# EAGLE design RTC_pb (EAGLE 6.1)
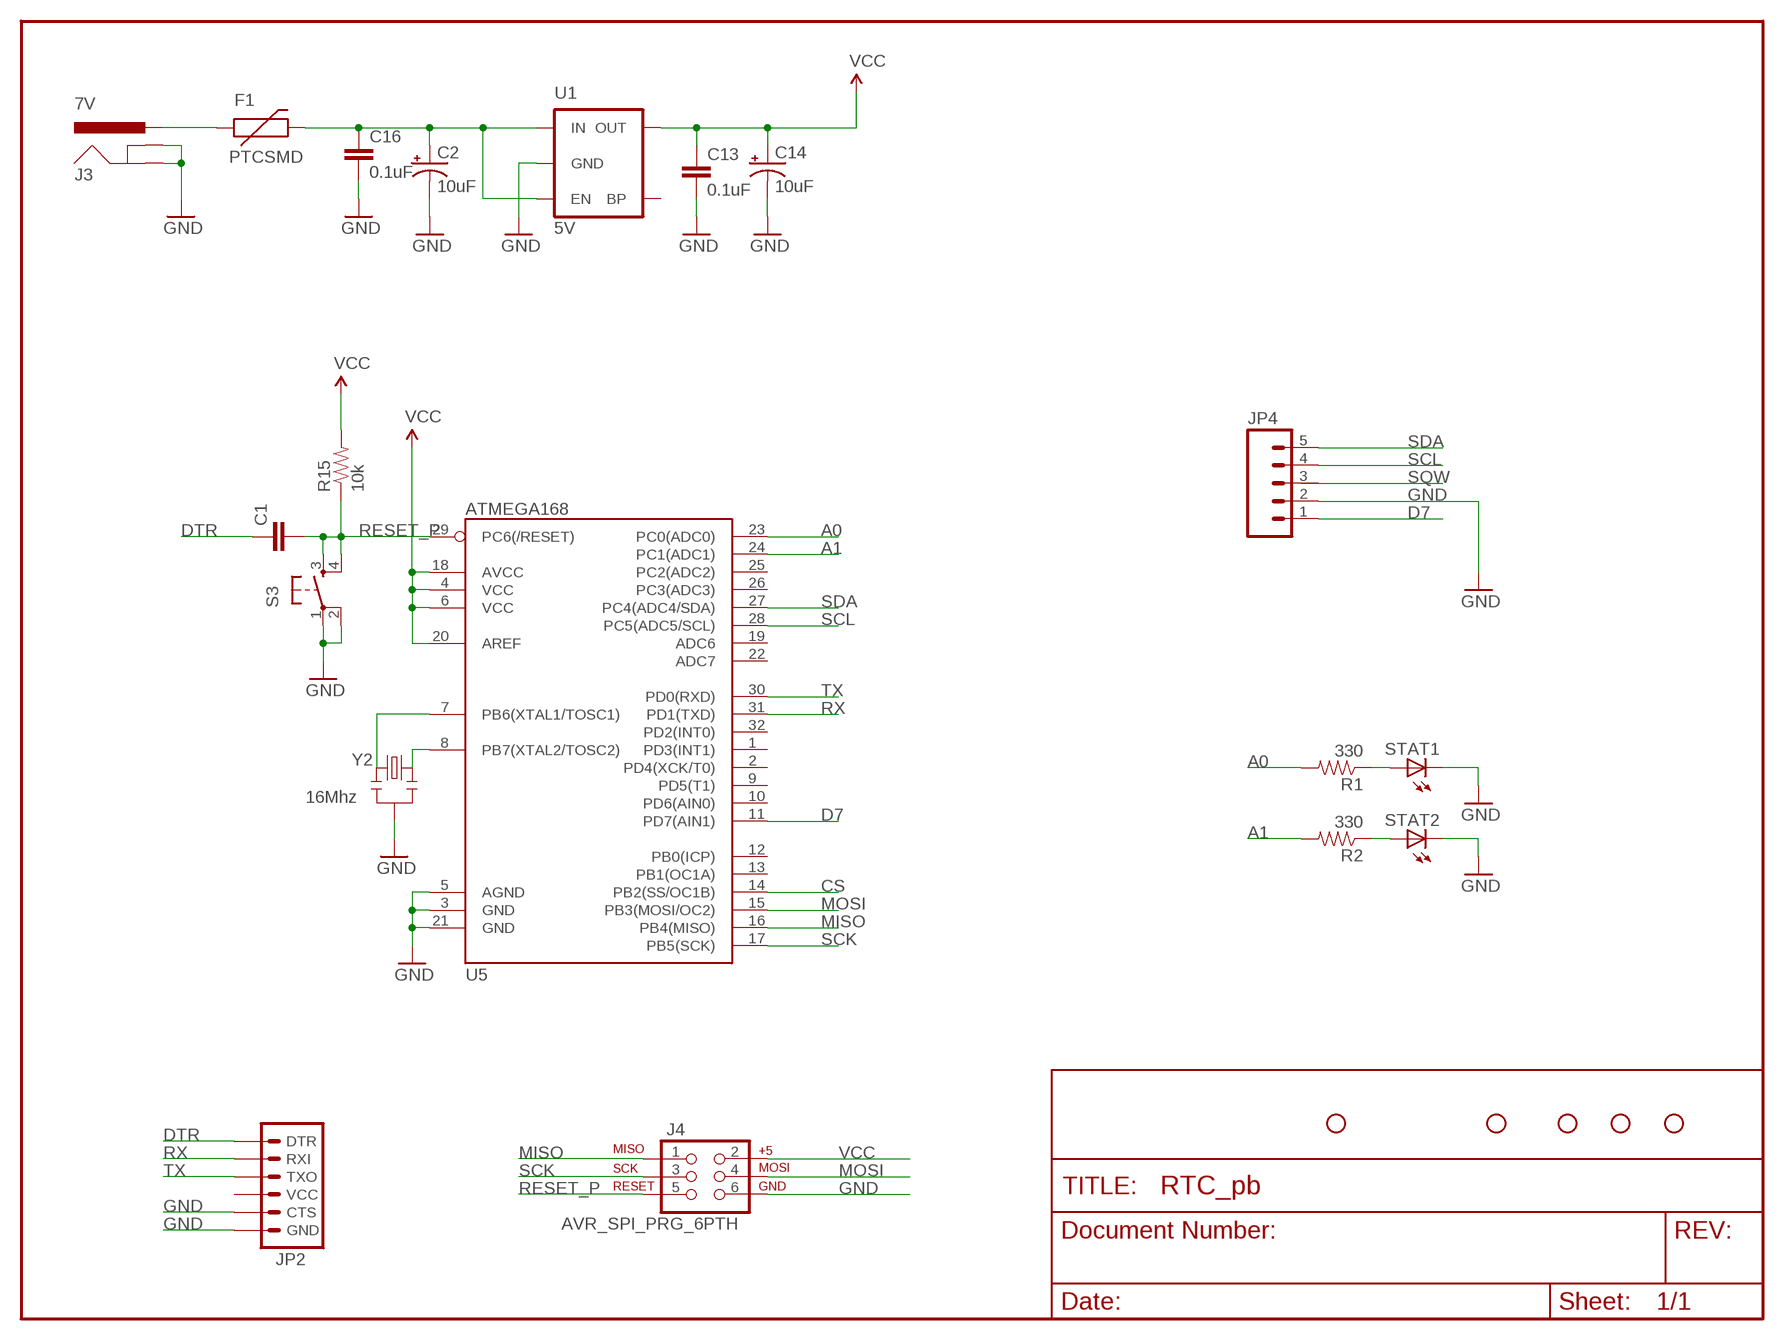
[diagram p0: schematic, sheet 1]

## Parts
C1  CAP0603-CAP  [0603-CAP]
C2  10uF  CAP_POL1206  [EIA3216]
C13  0.1uF  CAP0603-CAP  [0603-CAP]
C14  10uF  CAP_POL1206  [EIA3216]
C16  0.1uF  CAP0603-CAP  [0603-CAP]
F1  PTCSMD  [PTC-1206]
J3  7V  POWER_JACKPTH_LOCK  [POWER_JACK_PTH_LOCK]
J4  AVR_SPI_PRG_6PTH  [2X3]
JP1  STAND-OFFTIGHT  [STAND-OFF-TIGHT]
JP2  ARDUINO_SERIAL_PROGRAMPTH  [1X06]
JP4  M05PTH_LONGPADS  [1X05_LONGPADS]
JP7  STAND-OFFTIGHT  [STAND-OFF-TIGHT]
JP8  STAND-OFFTIGHT  [STAND-OFF-TIGHT]
JP9  STAND-OFFTIGHT  [STAND-OFF-TIGHT]
JP10  STAND-OFFTIGHT  [STAND-OFF-TIGHT]
R1  330  RESISTOR0603-RES  [0603-RES]
R2  330  RESISTOR0603-RES  [0603-RES]
R15  10k  RESISTOR0603-RES  [0603-RES]
S3  TAC_SWITCHPTH  [TACTILE-PTH]
STAT1  Yellow  LED1206  [LED-1206]
STAT2  Yellow  LED1206  [LED-1206]
U1  3.3V  V_REG_LDOSMD  [SOT23-5]
U5  ATMEGA168  [TQFP32-08]
Y2  8MHz  RESONATORSMD  [RESONATOR-SMD]

## Nets
A0: R1.2 U5.23(PC0(ADC0))
A1: R2.2 U5.24(PC1(ADC1))
CS: U5.14(PB2(SS/OC1B))
D7: JP4.1 U5.11(PD7(AIN1))
DTR: C1.1 JP2.1(DTR)
GND: C2.C(-) C13.2 C14.C(-) C16.2 J3.GND J3.GNDBREAK J4.6 JP2.5(CTS) JP2.6(GND) JP4.2 S3.1 S3.2 STAT1.C STAT2.C U1.2(GND) U5.3(GND) U5.5(AGND) U5.21(GND) Y2.2
MISO: J4.1 U5.16(PB4(MISO))
MOSI: J4.4 U5.15(PB3(MOSI/OC2))
N$1: R1.1 STAT1.A
N$2: R2.1 STAT2.A
N$4: C2.A(+) C16.1 F1.2 U1.1(IN) U1.3(EN)
N$141: U5.8(PB7(XTAL2/TOSC2)) Y2.3
N$142: U5.7(PB6(XTAL1/TOSC1)) Y2.1
RAW: F1.1 J3.PWR
RESET_P: C1.2 J4.5 R15.1 S3.3 S3.4 U5.29(PC6(/RESET))
RX: JP2.2(RXI) U5.31(PD1(TXD))
SCK: J4.3 U5.17(PB5(SCK))
SCL: JP4.4 U5.28(PC5(ADC5/SCL))
SDA: JP4.5 U5.27(PC4(ADC4/SDA))
TX: JP2.3(TXO) U5.30(PD0(RXD))
VCC: C13.1 C14.A(+) J4.2 R15.2 U1.5(OUT) U5.4(VCC) U5.6(VCC) U5.18(AVCC) U5.20(AREF)
Unconnected: JP2.4(VCC) JP4.3 U1.4(BP) U5.1(PD3(INT1)) U5.2(PD4(XCK/T0)) U5.9(PD5(T1)) U5.10(PD6(AIN0)) U5.12(PB0(ICP)) U5.13(PB1(OC1A)) U5.19(ADC6) U5.22(ADC7) U5.25(PC2(ADC2)) U5.26(PC3(ADC3)) U5.32(PD2(INT0))

## Notes on the sheet
- 5V
- 16Mhz

## Library data of the parts
C1 C13 C16 = SparkFun:CAP: Capacitor Standard 0603 ceramic capacitor, and 0.1" leaded capacitor.
C2 C14 = SparkFun:CAP_POL: Capacitor Polarized These are standard SMD and PTH capacitors. Normally 10uF, 47uF, and 100uF in electrolytic and tantalum varieties. Always verify the external diameter of the through hole cap, it varies with capacity, voltage, and manufacturer. The EIA devices should be standard.
F1 = SparkFun:PTC: Resettable Fuse PTC Resettable Fuse. Spark Fun Electronics SKU : COM-08357
J3 = SparkFun:POWER_JACK: Power Jack This is the standard 5.5mm barrel jack for power. The PTH is the most common, proven, reliable, footprint. All others are experimental. The Slot footprint only works if the mill layer is transmitted to the PCB fab house so be warned. Spark Fun Electronics SKU : PRT-00119. Mating wall wart : TOL-00298 (and others)
J4 = SparkFun:AVR_SPI_PRG_6: AVR ISP 6 Pin This is the reduced ISP connector for AVR programming. Common on Arduino. This footprint will take up less PCB space and can be used with a 10-pin to 6-pin adapter such as SKU: BOB-08508
JP1 JP7-JP10 = SparkFun:STAND-OFF: Stand Off This is the mechanical footprint for a #4 phillips button head screw. Use the keepout ring to avoid running the screw head into surrounding components. SKU : PRT-00447
JP2 = SparkFun:ARDUINO_SERIAL_PROGRAM
JP4 = SparkFun:M05: Header 5 Standard 5-pin 0.1" header. Use with straight break away headers (SKU : PRT-00116), right angle break away headers (PRT-00553), swiss pins (PRT-00743), machine pins (PRT-00117), and female headers (PRT-00115). Molex polarized connector foot print use with SKU : PRT-08230 with associated crimp pins and housings.
R1 R2 R15 = SparkFun:RESISTOR: Resistor Basic schematic elements and footprints for 0603, 1206, and PTH resistors.
S3 = SparkFun:TAC_SWITCH: Momentary Switch Button commonly used for reset or general input. Spark Fun Electronics SKU : COM-00097
STAT1 STAT2 = SparkFun:LED: LEDs Standard schematic elements and footprints for 5mm, 3mm, 1206, and 0603 sized LEDs. 5mm - Spark Fun Electronics SKU : COM-00529 (and others)
U1 = SparkFun:V_REG_LDO: Voltage Regulator LDO Standard 150mA LDO voltage regulator in SOT-23 layout. Micrel part MIC5205. BP (by-pass) pin is used to lower output noise with 470pF cap.
U5 = SparkFun:ATMEGA168
Y2 = SparkFun:RESONATOR: Resonator Small SMD resonator. This is the itty bitty 10/20MHz resonators with built in caps. CSTCE10M0G55 and CSTCE20M0V53. Footprint has been reviewed closely but hasn't been tested yet.

## Board
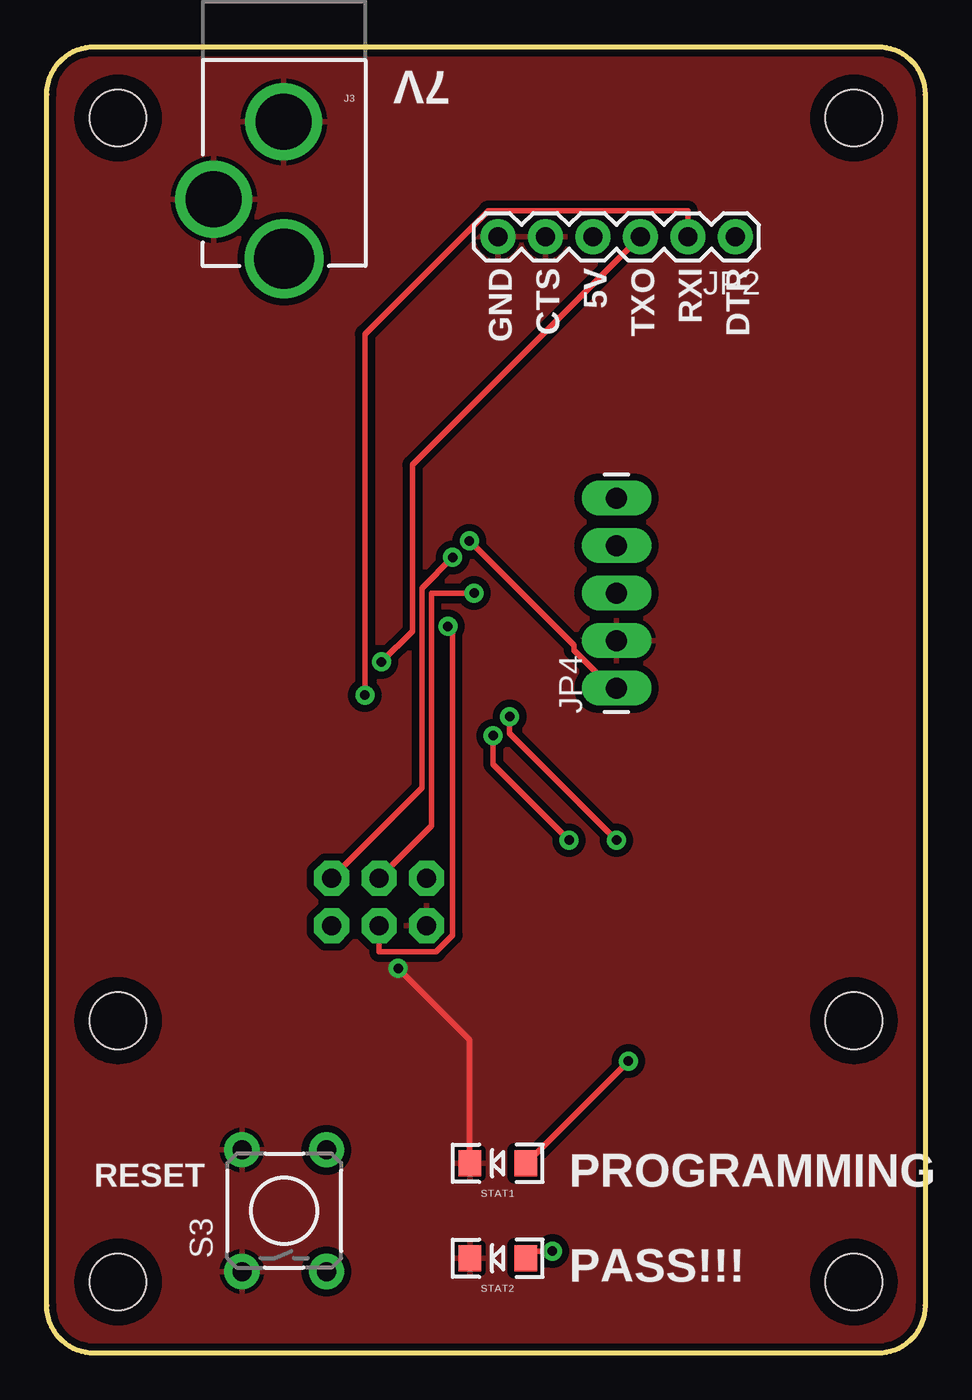
[diagram p1: board, top side]
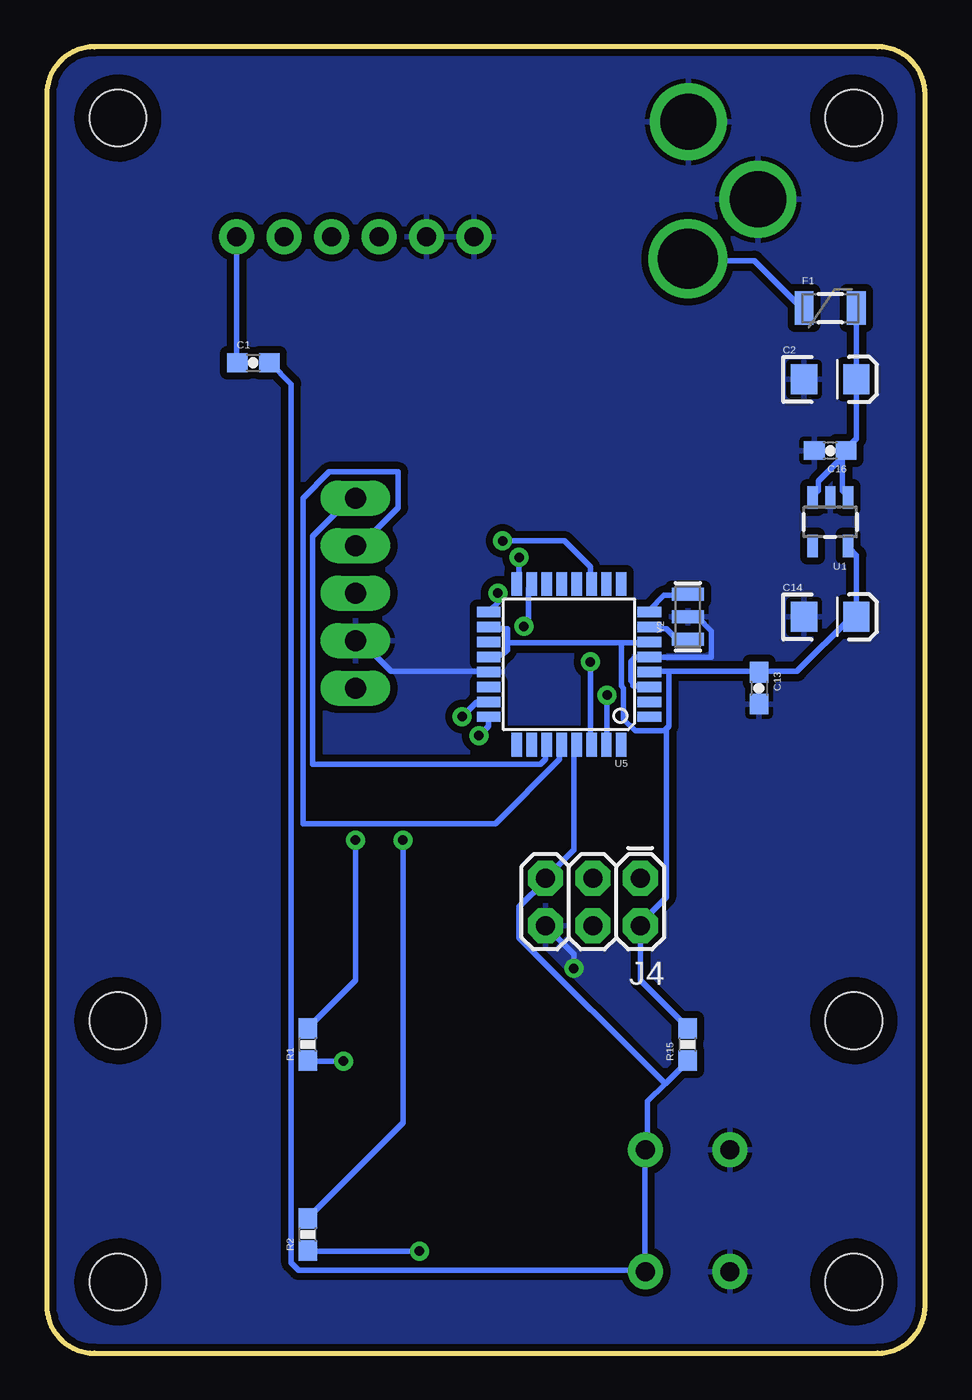
[diagram p2: board, bottom side, seen from below]

Size 46.99 x 69.85 mm. Coordinates in mm from the lower left corner, seen from the top.
Outline: 2.54,0 arc-90 0,2.54 0,67.31 arc-90 2.54,69.85 44.45,69.85 arc-90 46.99,67.31 46.99,2.54 arc-90 44.45,0 2.54,0
Copper layers (1*16): Top 0.035mm / dielectric 1.5mm / Bottom 0.035mm
Design rules: minimum track width 12mil, minimum drill 20mil, track to track 8mil, track to pad 8mil, pad to pad 8mil, via to via 8mil, smd to smd 8mil, copper to edge 8mil, drill to drill 8mil, minimum pad ring 12mil, minimum via ring 10mil, stop-mask expansion 4mil, vias tented up to drill 20mil, thermal gap 10mil

### Footprints (pad centres in the part's own frame; a part is rotated, then mirrored left to right if it is on the bottom)
0603-CAP = smd 1.1 x 1: 1 -0.85,0; 2 0.85,0
EIA3216 = smd 1.4 x 1.6: A 1.4,0; C -1.4,0
PTC-1206 = smd 1 x 1.8: 1 -1.4,0; 2 1.4,0
POWER_JACK_PTH_LOCK = drill 2.997 pad 4.115: GND 0.025,6.557; GNDBREAK 3.762,10.7 | drill 3.2 pad 4.115: PWR 0,13.878
2X3 = drill 1.016 pad 1.88 octagon: 1 0,0; 2 0,2.54; 3 2.54,0; 4 2.54,2.54; 5 5.08,0; 6 5.08,2.54
STAND-OFF-TIGHT = hole 3.048: 0,0
1X06 = drill 1.016 pad 1.88: 1 0,0; 2 2.54,0; 3 5.08,0; 4 7.62,0; 5 10.16,0; 6 12.7,0
1X05_LONGPADS = drill 1.118 pad 1.88 long: 1 0,0; 2 2.54,0; 3 5.08,0; 4 7.62,0; 5 10.16,0
0603-RES = smd 1.1 x 1: 1 -0.85,0; 2 0.85,0
TACTILE-PTH = drill 1.016 pad 1.88: 1 -3.251,2.261; 2 3.251,2.261; 3 -3.251,-2.261; 4 3.251,-2.261
LED-1206 = smd 1.2 x 1.4: A -1.5,0; C 1.5,0
SOT23-5 = smd 0.55 x 1.2: 1 -0.95,-1.3; 2 0,-1.3; 3 0.95,-1.3; 4 0.95,1.3; 5 -0.95,1.3
TQFP32-08 = smd 1.27 x 0.559: 1 -4.293,2.8; 2 -4.293,2; 3 -4.293,1.2; 4 -4.293,0.4; 5 -4.293,-0.4; 6 -4.293,-1.2; 7 -4.293,-2; 8 -4.293,-2.8; 17 4.293,-2.8; 18 4.293,-2; 19 4.293,-1.2; 20 4.293,-0.4; 21 4.293,0.4; 22 4.293,1.2; 23 4.293,2; 24 4.293,2.8 | smd 0.559 x 1.27: 9 -2.8,-4.293; 10 -2,-4.293; 11 -1.2,-4.293; 12 -0.4,-4.293; 13 0.4,-4.293; 14 1.2,-4.293; 15 2,-4.293; 16 2.8,-4.293; 25 2.8,4.293; 26 2,4.293; 27 1.2,4.293; 28 0.4,4.293; 29 -0.4,4.293; 30 -1.2,4.293; 31 -2,4.293; 32 -2.8,4.293
RESONATOR-SMD = smd 0.7 x 1.7: 1 -1.2,0; 2 0,0; 3 1.2,0

### Placement (x,y rotation side)
C1  35.94,52.96 0 bottom
C2  5.08,52.07 0 bottom
C13  8.89,35.56 270 bottom
C14  5.08,39.37 0 bottom
C16  5.08,48.26 180 bottom
F1  5.08,55.88 0 bottom
J3  12.7,72.39 180 top
J4  15.24,25.4 180 bottom
JP1  43.18,3.81 0 top
JP2  36.83,59.69 180 top
JP3  STAND-OFFTIGHT  [STAND-OFF-TIGHT]  3.81,3.81 0 top
JP4  30.48,35.56 90 top
JP7  43.18,66.04 0 top
JP8  3.81,17.78 0 top
JP9  43.18,17.78 0 top
JP10  3.81,66.04 0 top
R1  33.02,16.51 90 bottom
R2  33.02,6.35 90 bottom
R15  12.7,16.51 90 bottom
S3  12.7,7.62 90 top
STAT1  24.13,10.16 180 top
STAT2  24.13,5.08 180 top
U1  5.08,44.45 180 bottom
U5  19.05,36.83 180 bottom
Y2  12.7,39.37 90 bottom

### Tracks (layer width: path | path; a pad name or v marks a point on that pad's centre or on a via)
A0  (via drill 0.51)
  Top 0.305: v30.48,27.43 24.77,33.15 v24.77,34.04
  Bottom 0.305: v30.48,27.43 30.48,19.94 33.02,17.4 R1.2 | v24.77,34.04 24,34.8 23.37,34.8 U5.23
A1  (via drill 0.51)
  Top 0.305: v27.94,27.43 23.88,31.5 v23.88,33.02
  Bottom 0.305: v27.94,27.43 27.94,12.32 33.02,7.24 R2.2 | v23.88,33.02 23.37,33.53 23.37,33.91 U5.24
D7  (via drill 0.51)
  Top 0.305: v22.61,43.43 28.19,37.85 28.19,37.59 30.23,35.56 JP4.1
  Bottom 0.305: v22.61,43.43 19.3,43.43 17.91,42.04 17.91,41.15 U5.11
DTR
  Bottom 0.305: JP2.1 36.83,52.96 C1.1
GND  (via drill 0.51)
  Top 0.305: v18.8,20.57 22.61,16.76 22.61,10.16 STAT1.C
  Bottom 0.305: JP4.2 30.23,38.1 28.57,36.45 23.37,36.45 U5.21 | J4.6 18.8,21.34 v18.8,20.57 | JP2.5 26.57,59.79 | 24.26,59.69 JP2.6 | U5.3 14.86,35.69 15.62,35.69 15.62,35.81 15.75,35.94 15.75,36.96 15.49,37.21 14.86,37.21 U5.5 14.61,37.21 11.43,37.21 11.43,38.61 12.19,39.37 Y2.2
  pour Bottom (isolate 0.381): 0,0 46.99,0 46.99,69.85 0,69.85
  pour Top (isolate 0.381): 0,0 46.99,0 46.99,69.85 0,69.85
MISO  (via drill 0.51)
  Top 0.305: v21.72,42.55 20.07,40.89 20.07,30.23 J4.1
  Bottom 0.305: v21.72,42.55 21.72,41.27 21.84,41.15 U5.16
MOSI  (via drill 0.51)
  Top 0.305: v21.46,38.86 21.72,38.61 21.72,22.35 20.83,21.46 17.78,21.46 J4.4
  Bottom 0.305: v21.46,38.86 21.21,39.12 21.21,40.89 21.08,41.02 U5.15
N$1  (via drill 0.51)
  Top 0.305: v31.11,15.62 25.65,10.16 STAT1.A
  Bottom 0.305: v31.11,15.62 33.02,15.62 R1.1
N$2  (via drill 0.51)
  Top 0.305: v27.05,5.46 25.65,5.46 25.65,5.08 STAT2.A
  Bottom 0.305: v27.05,5.46 33.02,5.46 R2.1
N$4
  Bottom 0.305: 4.19,48.26 C16.1 | 4.51,47.82 4.32,48.01 C16.1 | 4.51,47.82 5.71,46.61 5.71,46.1 5.84,46.1 5.84,45.97 5.97,45.85 U1.3 | F1.2 C2.A 3.68,51.94 3.68,48.9 4.19,48.39 C16.1 | U1.1 4.19,45.85 4.45,46.1 4.45,47.75 4.51,47.82
N$141
  Bottom 0.305: U5.8 14.73,39.75 13.97,40.51 12.7,40.51 Y2.3
N$142
  Bottom 0.305: U5.7 14.73,38.73 13.84,38.73 13.34,38.23 12.7,38.23 Y2.1
RAW
  Bottom 0.305: F1.1 6.6,55.88 9.14,58.42 12.7,58.42 J3.PWR
RESET_P
  Bottom 0.305: 13.91,14.41 14.86,13.46 14.86,10.92 S3.4 14.99,10.79 14.99,4.57 S3.3 14.99,4.45 33.53,4.45 33.91,4.83 33.91,51.82 35.05,52.96 C1.2 | 13.91,14.41 12.7,15.62 R15.1 | 13.91,14.41 21.72,22.23 21.72,23.88 20.32,25.27 J4.5 18.8,26.92 18.8,32.51 18.67,32.51 U5.29
RX  (via drill 0.51)
  Top 0.305: JP2.2 34.29,61.09 23.62,61.09 17.02,54.48 v17.02,35.18
  Bottom 0.305: v17.02,35.18 17.02,32.64 U5.31
SCK  (via drill 0.51)
  Top 0.305: v22.86,40.64 20.57,40.64 20.57,28.19 J4.3
  Bottom 0.305: v22.86,40.64 22.86,40.13 23.24,39.75 U5.17
SCL
  Bottom 0.305: JP4.4 30.23,43.18 28.19,45.21 28.19,47.12 31.88,47.12 33.27,45.72 33.27,28.32 22.99,28.32 19.56,31.75 19.56,32.51 U5.28
SDA
  Bottom 0.305: JP4.5 30.73,45.72 32.77,43.69 32.77,31.5 20.57,31.5 20.32,31.75 20.32,32.51 U5.27
TX  (via drill 0.51)
  Top 0.305: JP2.3 19.56,47.5 19.56,38.61 v17.91,36.96
  Bottom 0.305: v17.91,36.96 17.91,32.64 U5.30
VCC
  Bottom 0.305: R15.2 12.7,17.4 15.24,19.94 J4.2 15.24,22.99 13.84,24.38 13.84,33.27 13.91,33.34 | U1.5 4.06,43.05 3.68,42.67 C14.A | 3.81,39.37 C14.A | C14.A 3.94,39.37 6.86,36.45 8.76,36.45 C13.1 9.02,36.45 13.72,36.45 | 13.72,36.45 14.73,36.45 U5.4 | 22.35,37.97 16.26,37.97 | 16.26,37.97 14.86,37.97 U5.6 | 22.35,37.97 22.35,37.59 22.61,37.34 23.24,37.34 U5.20 | 22.35,37.97 22.35,38.73 23.24,38.73 U5.18 | 13.72,36.45 13.72,33.53 13.91,33.34 | 13.91,33.34 13.97,33.27 15.49,33.27 16.13,33.91 16.13,35.56 16.26,35.69 16.26,37.97

### Text on the board
tPlace: 7V | GND | CTS | 5V | TXO | RXI | DTR | RESET | PROGRAMMING | PASS!!!
Reference: SDA | SCL | SQW | GND | 5V